# Altium schematic sheet 02_MCU_PERIPHERAL.SchDoc
size A4
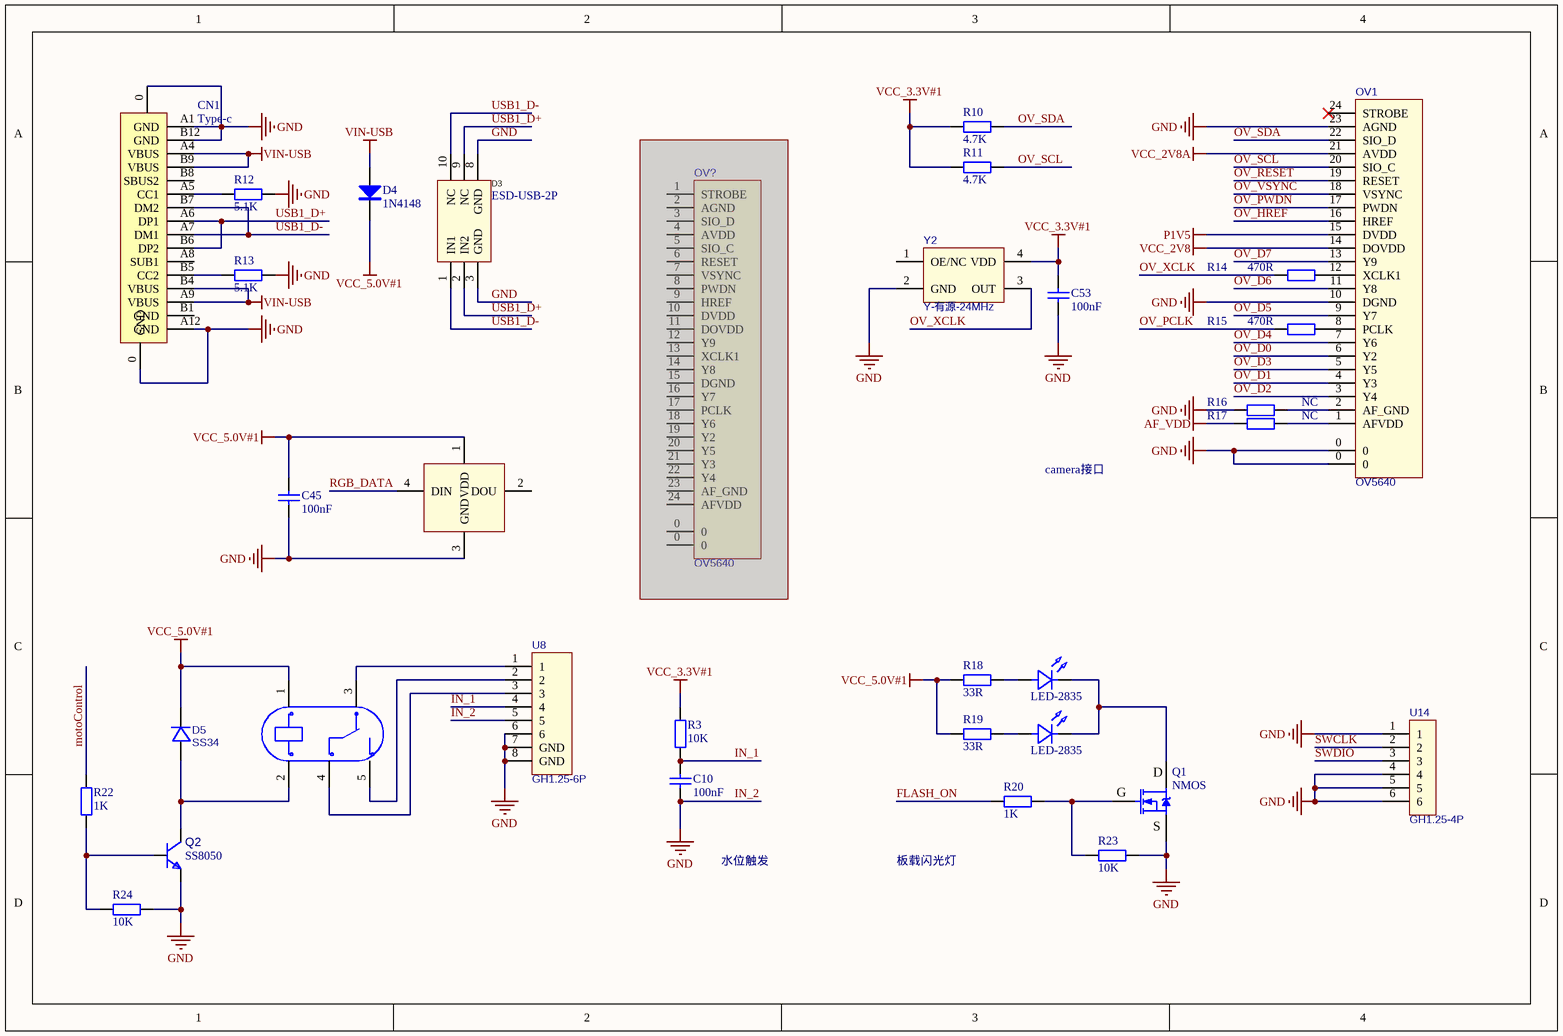
[diagram p0: 02_MCU_PERIPHERAL.SchDoc]

## Parts
C10  100nF  [0603-C]
C45  100nF  [0603-C]
C53  100nF  [0603-C]
CN1  Type-c  [Type-c 16pin]
D3  ESD-USB-2P  [SLP2510P8-2P]
D4  1N4148  [1N4148W]
D5  SS34  [SS34-SMA]
K1  JQC-3FF/005-1ZS(551)  [RELAY-TH_HF3FF-XX-1ZXX-XXX]  (value not drawn)
LED1  WS2812B-5050  [WS2812B-5050]  (value not drawn)
OV1  OV5640  [FPC-SMD_P0.50-24P_XJ-FGS]
OV?  OV5640  [FPC-SMD_P0.50-24P_XJ-FGS]  (masked out: inside a compile mask, not in the netlist)
Q1  NMOS  [AO3400]
Q2  SS8050  [SOT23-3M]
R3  10K  [0603-R]
R10  4.7K  [0603-R]
R11  4.7K  [0603-R]
R12  5.1K  [0603-R]
R13  5.1K  [0603-R]
R14  470R  [0603-R]
R15  470R  [0603-R]
R16  NC  [0603-R]
R17  NC  [0603-R]
R18  33R  [1206-R]
R19  33R  [1206-R]
R20  1K  [0603-R]
R22  1K  [0603-R]
R23  10K  [0603-R]
R24  10K  [0603-R]
U8  GH1.25-6P  [CONN-SMD_A1257WR-S-6P]
U9  LED-2835  [LED-SMD_L3.5-W2.8-FD-2835_WHITE]
U10  LED-2835  [LED-SMD_L3.5-W2.8-FD-2835_WHITE]
U14  GH1.25-4P  [CONN-SMD_GH1.25-4PWBPZ]
Y2  Y-有源-24MHz  [3225]

## Nets
AF_VDD: R17.2
GND: C10.1 C45.1 C53.1 CN1.0(GND) CN1.A1(GND) CN1.A12(GND) CN1.B12(GND) D3.3(GND) D3.8(GND) LED1.3(GND) OV1.0 OV1.10(DGND) OV1.23(AGND) Q1.2(S) Q2.2(E) R12.2 R13.2 R16.2 R23.1 R24.1 U8.5 U8.6 U8.7(GND) U8.8(GND) U14.1 U14.4 U14.5 U14.6 Y2.2(GND)  [also labelled IN_2]
P1V5: OV1.15(DVDD)
VCC_2V8: OV1.14(DOVDD)
VCC_2V8A: OV1.21(AVDD)
VCC_3.3V#1: C53.2 R3.2 R10.2 R11.2 Y2.4(VDD)
VCC_5.0V#1: C45.2 D4.2(K) D5.2(-) K1.1 LED1.1(VDD) R18.2 R19.2
VIN-USB: CN1.A4(VBUS) CN1.A9(VBUS) CN1.B4(VBUS) CN1.B9(VBUS) D4.1(A)
FLASH_ON: R20.2
IN_1: C10.2 R3.1 U8.4
motoControl: R22.2
OV_D0: OV1.6(Y2)
OV_D1: OV1.4(Y3)
OV_D2: OV1.3(Y4)
OV_D3: OV1.5(Y5)
OV_D4: OV1.7(Y6)
OV_D5: OV1.9(Y7)
OV_D6: OV1.11(Y8)
OV_D7: OV1.13(Y9)
OV_HREF: OV1.16(HREF)
OV_PCLK: R15.2
OV_PWDN: OV1.17(PWDN)
OV_RESET: OV1.19(RESET)
OV_SCL: OV1.20(SIO_C) R11.1
OV_SDA: OV1.22(SIO_D) R10.1
OV_VSYNC: OV1.18(VSYNC)
OV_XCLK: R14.2 Y2.3(OUT)
RGB_DATA: LED1.4(DIN)
SWCLK: U14.2
SWDIO: U14.3
USB1_D+: CN1.A6(DP1) CN1.B6(DP2) D3.2(IN2) D3.9(NC)
USB1_D-: CN1.A7(DM1) CN1.B7(DM2) D3.1(IN1) D3.10(NC)
NetCN1_A5: CN1.A5(CC1) R12.1
NetCN1_B5: CN1.B5(CC2) R13.1
NetD5_1: D5.1(+) K1.2 Q2.3(C)
NetK1_3: K1.3 U8.1
NetK1_4: K1.4 U8.3
NetK1_5: K1.5 U8.2
NetOV1_1: OV1.1(AFVDD) R17.1
NetOV1_2: OV1.2(AF_GND) R16.1
NetOV1_8: OV1.8(PCLK) R15.1
NetOV1_12: OV1.12(XCLK1) R14.1
NetQ1_1: Q1.1(G) R20.1 R23.2
NetQ1_3: Q1.3(D) U9.1(K) U10.1(K)
NetQ2_1: Q2.1(B) R22.1 R24.2
NetR18_1: R18.1 U9.2(A)
NetR19_1: R19.1 U10.2(A)

Not connected (* = marked no-connect by the designer): CN1 A8(SUB1) B1(GND) B8(SBUS2); LED1 2(DOU); OV1 24(STROBE)*; Y2 1(OE/NC)

## Notes on the sheet
- camera接口
- 水位触发
- 板载闪光灯

## Library data of the parts
C10 C45 C53 = C: 贴片电容; BOM名称: 无极性贴片电容; 联系卖家，免费查找封装: 唯一出售店铺网址https://shop463601444.taobao.com
CN1 = Type-c: U262-161N-4BVC11
D3 = ESD-USB-2P: RClamp0522PATCT; Manufacturer: SEMTECH; Name: RClamp0524PATCT; Device: RClamp0524PATCT_C40960; Add into BOM: yes; Reverse Stand-Off Voltage (Vrwm): 5V; Breakdown Voltage (VBR): 6V; Clamping Voltage@Ipp: 15V; Peak Pulse Power(Ppp)@8/20us: 150W; Junction Capacitance(Cj)@1MHz: 0.8pF@1MHz; Symbol: RClamp0524PATCT; LCSC Part Name: RClamp0524PATCT; Supplier Part: C40960; Manufacturer Part: RClamp0524PATCT; Supplier Footprint: SLP2510P8; JLCPCB Part Class: Extended Part; Datasheet: https://atta.szlcsc.com/upload/public/pdf/source/20150124/1457707260739.pdf; Supplier: LCSC; Convert to PCB: yes; Operating Temperature: -55℃~+125℃@(Tj)
D4 = 1N4148W: 整流二极管; 版权归属: 源创客; BOM名称: 整流二极管; 学习资源: www.ooocke.com
D5 = SS34: BOM_Manufacturer: Wuxi ARK Tech Elec; BOM_Manufacturer Part: D-G060306G1-KS2; Contributor: LCSC; BOM_Supplier: LCSC; BOM_Supplier Part: C118334; BOM_JLCPCB Part Class: Extended Part; spicePre: L; spiceSymbolName: D-G060306G1-KS2
K1 = JQC-3FF/005-1ZS(551): Manufacturer: HF(宏发); Symbol: JQC-3FF/05-1ZS(551); Add into BOM: yes; Coil Voltage: 5V; Coil Type: 非极化-单线圈; Pin Number: 5; Contact Form: 一组转换:1C(单刀双掷-转换); Maximum Switching Current: 10A; Maximum Switching Voltage: 277V@AC；30V@DC; Coil Rated Power: 360mW; Contact Rating: 10A@28VDC；10A@277VAC; Coil Resistance: 70Ω; Operate Time: 10ms; Release Time: 5ms; Contact Resistance: 100mΩ; Name: JQC-3FF/005-1ZS(551); Device: JQC-3FF/005-1ZS(551); LCSC Part Name: 超小型大功率5V继电器 单刀双掷; Supplier Part: C9221; Manufacturer Part: JQC-3FF/005-1ZS(551); Supplier Footprint: 插件,15.5x19mm; JLCPCB Part Class: Extended Part; Datasheet: https://atta.szlcsc.com/upload/public/pdf/source/20210906/31FD0911648F640D4227475E890A46EB.pdf; Supplier: LCSC; Convert to PCB: yes; Contact Material: AgCdO; Operating Temperature: -40℃~+85℃
LED1 = WS2812B-5050: Manufacturer: XINGLIGHT(成兴光); Name: XL-5050RGBC-WS2812B; Add into BOM: yes; Emitted Color: RGB三色; Lens Color: 无色透明; Peak Wavelength: 625nm；470nm；530nm; Viewing Angle: 120°; Mounting Sytle: 正贴; Symbol: XL-5050RGBC-WS2812B; Device: XL-5050RGBC-WS2812B; LCSC Part Name: RGB三色 正贴 幻彩; Supplier Part: C2843785; Manufacturer Part: XL-5050RGBC-WS2812B; Supplier Footprint: SMD5050; JLCPCB Part Class: Extended Part; Datasheet: https://atta.szlcsc.com/upload/public/pdf/source/20230111/86AAD2096485A2E5BCAB883FF8CBE6FD.pdf; Supplier: LCSC; Convert to PCB: yes; Diode Configuration: -; Dominant Wavelength: -; Color Temperature: -; Forward Current: -; Power Dissipation: -; Operating Temperature: -30℃~+70℃
OV1 = OV5640_BACK: BOM_Manufacturer: Shenzhen Cankemeng; Contributor: LCSC; BOM_Supplier: LCSC; BOM_Supplier Part: C132514; BOM_Manufacturer Part: -; BOM_JLCPCB Part Class: Extended Part; spicePre: F; spiceSymbolName: FPC0.5-24P
OV? = OV5640: BOM_Manufacturer: Shenzhen Cankemeng; Contributor: LCSC; BOM_Supplier: LCSC; BOM_Supplier Part: C132514; BOM_Manufacturer Part: -; BOM_JLCPCB Part Class: Extended Part; spicePre: F; spiceSymbolName: FPC0.5-24P
Q1 = AO3400: N沟道 30V/4.2A; BOM名称: 场效应管; 联系卖家，免费查找封装: 唯一出售店铺网址https://shop463601444.taobao.com; 参数: N沟道 30V/4.2A
R3 R10-R20 R22-R24 = R: 贴片电阻; 联系卖家，免费查找封装: 唯一出售店铺网址https://shop463601444.taobao.com; BOM名称: 贴片电阻
U8 = GH1.25-6P: GH1.25-4PWBPZ; BOM_Manufacturer: BOOMELE(博穆精密); Contributor: LCSC; BOM_Supplier: LCSC; BOM_Supplier Part: C2829253; BOM_Manufacturer Part: GH1.25-4PWBPZ; spicePre: U; spiceSymbolName: GH1.25-4PWBPZ
U9 U10 = LED-2835: Manufacturer: HONGLITRONIC(鸿利光电); Name: A2835W3H2-D01-8D2AB5; Add into BOM: yes; Symbol: A2835W3H2-D01-8D2AB5; Device: A2835W3H2-D01-8D2AB5; LCSC Part Name: 2835自然白3800-4250K 高性价比; Supplier Part: C7423445; Manufacturer Part: A2835W3H2-D01-8D2AB5; Supplier Footprint: 2835; JLCPCB Part Class: Extended Part; Datasheet: https://atta.szlcsc.com/upload/public/pdf/source/20230608/811871640B6DA35415197D15B0ECD5AB.pdf; Supplier: LCSC; Convert to PCB: yes
U14 = GH1.25-4P: GH1.25-4PWBPZ; BOM_Manufacturer: BOOMELE(博穆精密); Contributor: LCSC; BOM_Supplier: LCSC; BOM_Supplier Part: C2829253; BOM_Manufacturer Part: GH1.25-4PWBPZ; spicePre: U; spiceSymbolName: GH1.25-4PWBPZ
Y2 = Y-有源: 有源晶振; BOM_Manufacturer: YXC扬兴科技; BOM_Manufacturer Part: OT322540MJBA4SL; nameAlias: Frequency; Contributor: LCSC; BOM_Supplier: LCSC; BOM_Supplier Part: C2831396; BOM_JLCPCB Part Class: Extended Part; spicePre: X; spiceSymbolName: OT322540MJBA4SL